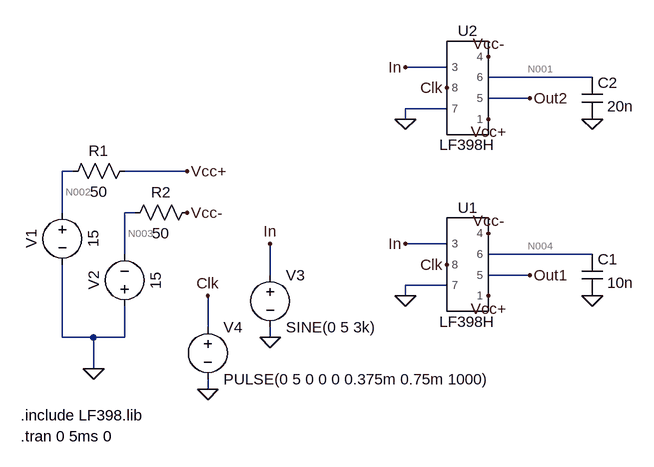
[diagram p0: schematic S&H.asc]
S&H.asc, the LTspice schematic file:
Version 4
SHEET 1 880 680
WIRE 192 -192 128 -192
WIRE 416 -176 256 -176
WIRE 320 -144 256 -144
WIRE 192 -128 128 -128
WIRE 128 -112 128 -128
WIRE -384 -32 -400 -32
WIRE -208 -32 -304 -32
WIRE -400 32 -400 -32
WIRE -288 32 -304 32
WIRE 192 80 128 80
WIRE -304 96 -304 32
WIRE 416 96 256 96
WIRE -80 128 -80 80
WIRE 320 128 256 128
WIRE 192 144 128 144
WIRE 128 160 128 144
WIRE -176 208 -176 160
WIRE -400 224 -400 112
WIRE -352 224 -400 224
WIRE -304 224 -304 176
WIRE -304 224 -352 224
WIRE -80 224 -80 208
WIRE -352 272 -352 224
WIRE -176 304 -176 288
FLAG -352 272 0
FLAG -208 -32 Vcc+
FLAG -208 32 Vcc-
FLAG 256 160 Vcc+
FLAG 256 64 Vcc-
FLAG 320 128 Out1
FLAG 128 80 In
FLAG 416 160 0
FLAG 128 160 0
FLAG 192 112 Clk
FLAG -80 224 0
FLAG -80 80 In
FLAG -176 304 0
FLAG -176 160 Clk
FLAG 256 -112 Vcc+
FLAG 256 -208 Vcc-
FLAG 320 -144 Out2
FLAG 128 -192 In
FLAG 416 -112 0
FLAG 128 -112 0
FLAG 192 -160 Clk
SYMBOL voltage -400 16 R0
WINDOW 0 -32 56 VBottom 2
WINDOW 3 32 56 VTop 2
WINDOW 123 0 0 Left 0
WINDOW 39 0 0 Left 0
SYMATTR InstName V1
SYMATTR Value 15
SYMBOL voltage -304 192 R180
WINDOW 0 32 56 VTop 2
WINDOW 3 -32 56 VBottom 2
WINDOW 123 0 0 Left 0
WINDOW 39 0 0 Left 0
SYMATTR InstName V2
SYMATTR Value 15
SYMBOL AutoGenerated\\LF398H 224 112 R0
SYMATTR InstName U1
SYMBOL cap 400 96 R0
WINDOW 3 39 44 Left 2
SYMATTR Value 10n
SYMATTR InstName C1
SYMBOL voltage -80 112 R0
WINDOW 123 0 0 Left 0
WINDOW 39 0 0 Left 0
SYMATTR InstName V3
SYMATTR Value SINE(0 5 3k)
SYMBOL voltage -176 192 R0
WINDOW 123 0 0 Left 0
WINDOW 39 0 0 Left 0
SYMATTR InstName V4
SYMATTR Value PULSE(0 5 0 0 0 0.375m 0.75m 1000)
SYMBOL res -288 -48 R90
WINDOW 0 0 56 VBottom 2
WINDOW 3 32 56 VTop 2
SYMATTR InstName R1
SYMATTR Value 50
SYMBOL res -192 16 R90
WINDOW 0 0 56 VBottom 2
WINDOW 3 32 56 VTop 2
SYMATTR InstName R2
SYMATTR Value 50
SYMBOL AutoGenerated\\LF398H 224 -160 R0
SYMATTR InstName U2
SYMBOL cap 400 -176 R0
WINDOW 3 39 44 Left 2
SYMATTR Value 20n
SYMATTR InstName C2
TEXT -464 344 Left 2 !.include LF398.lib
TEXT -464 376 Left 2 !.tran 0 5ms 0

The netlist it stands for:
* S&H.asc
V1 N002 0 15
V2 0 N003 15
XU1 In Clk 0 Vcc- N004 Out1 Vcc+ LF398H  ; pins 3 8 7 4 6 5 1
C1 N004 0 10n
V3 In 0 SINE(0 5 3k)
V4 Clk 0 PULSE(0 5 0 0 0 0.375m 0.75m 1000)
R1 Vcc+ N002 50
R2 Vcc- N003 50
XU2 In Clk 0 Vcc- N001 Out2 Vcc+ LF398H  ; pins 3 8 7 4 6 5 1
C2 N001 0 20n
.include LF398.lib
.tran 0 5ms 0
.lib C:\Users\Manuel Mollon\Dropbox\ASSD\LF398.lib
.backanno
.end

* Results of the author's LTspice run, read from the files saved beside the schematic
* Operating Point, zero values left out:
*   V(n002) = 15 V
*   V(n003) = -15 V
*   V(vcc+) = 14.58 V
*   V(vcc-) = -14.58 V
*   V(n004) = 477.2 µV
*   V(out1) = 477.2 µV
*   V(n001) = 477.2 µV
*   V(out2) = 477.2 µV
*   I(R2) = 8.333 mA
*   I(R1) = -8.333 mA
*   I(V3) = 7 nA
*   I(V2) = -8.333 mA
*   I(V1) = -8.333 mA
*   Ix(u1:3) = -3.5 nA
*   Ix(u1:4) = -4.167 mA
*   Ix(u1:1) = 4.167 mA
*   Ix(u2:3) = -3.5 nA
*   Ix(u2:4) = -4.167 mA
*   Ix(u2:1) = 4.167 mA
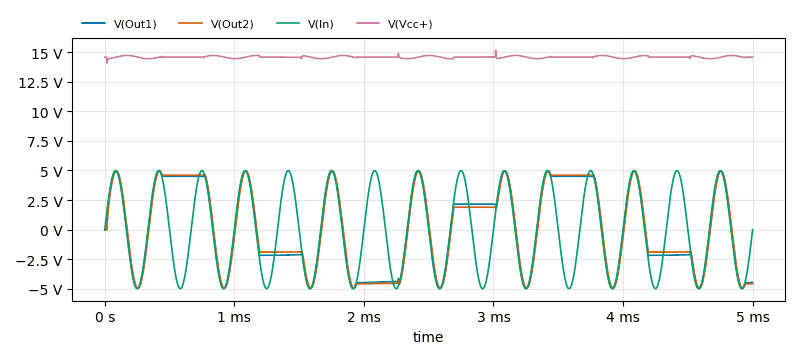
[diagram p1: Transient Analysis of S&H.asc, plotted from the saved traces]
* Transient Analysis, 1 run:
*   V(Out1): min -4.977 V, max 4.985 V, average 141.7 mV, rms 3.537 V, last -4.466 V
*   V(Out2): min -4.951 V, max 4.96 V, average 163.6 mV, rms 3.523 V, last -4.57 V
*   V(In): min -5 V, max 5 V, average 72.6 µV, rms 3.529 V, last 0 V
*   V(Vcc+): min 14.07 V, max 15.15 V, average 14.58 V, rms 14.58 V, last 14.58 V